# Altium project WaseyPad.PrjPcb
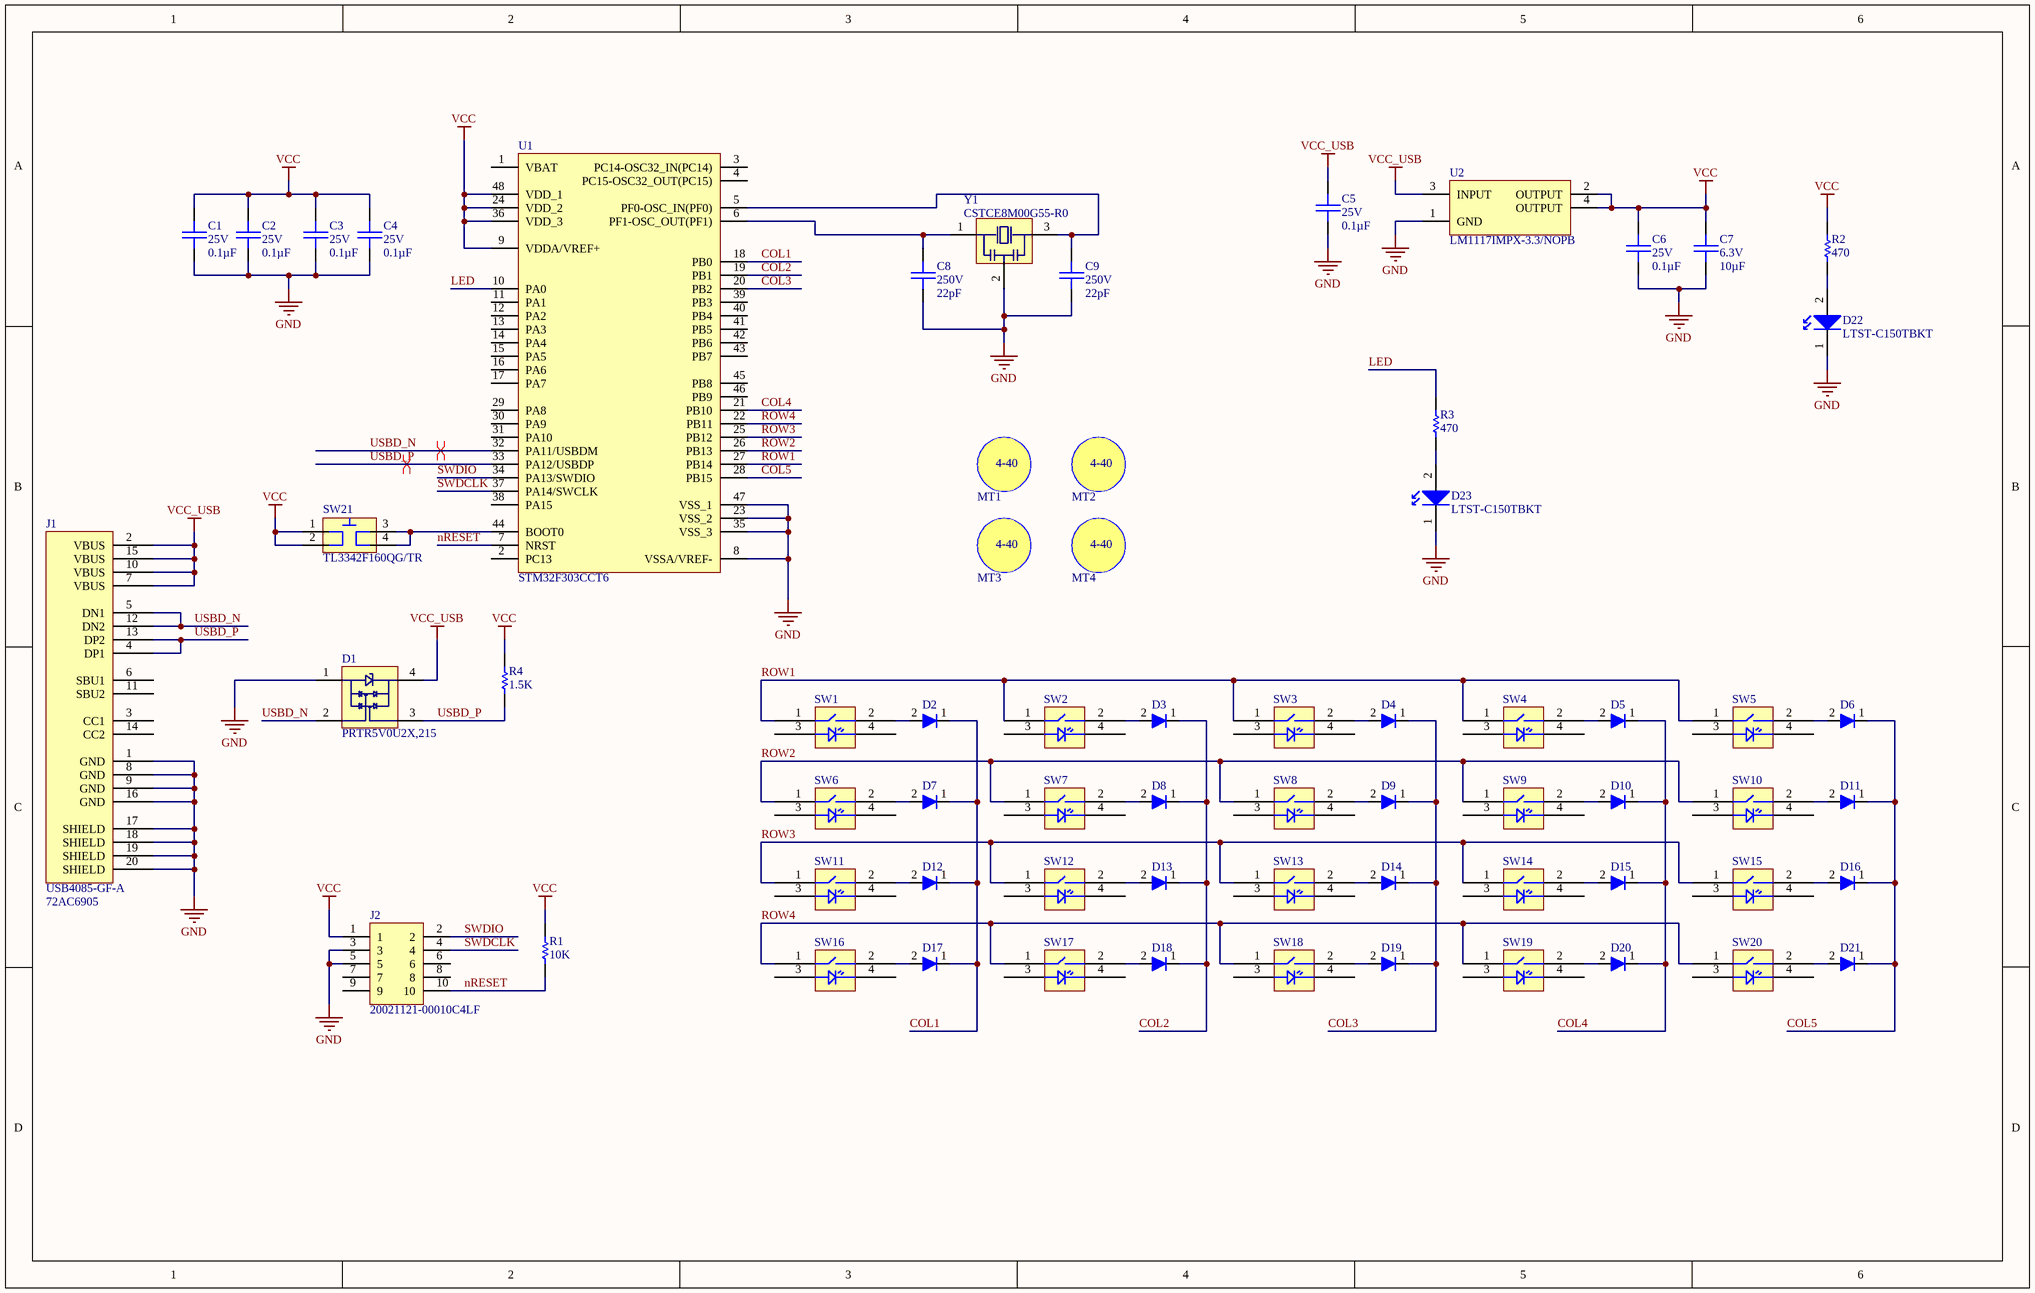
[diagram p0: Sheet1.SchDoc]
1 sheet, 66 parts. Net scope: global (net labels, ports and power ports of the same name join across sheets).
Board file: PCB1.PcbDoc

## Sheet Sheet1.SchDoc
size B

### Parts
C1  value 0.1µF  Voltage: 25V  [CAPC_0603(1.6X0.8)_N]  (hidden comment: Generic CAPC 0603 0.1µF 25V ±10% X7R)
C2  value 0.1µF  Voltage: 25V  [CAPC_0603(1.6X0.8)_N]  (hidden comment: Generic CAPC 0603 0.1µF 25V ±10% X7R)
C3  value 0.1µF  Voltage: 25V  [CAPC_0603(1.6X0.8)_N]  (hidden comment: Generic CAPC 0603 0.1µF 25V ±10% X7R)
C4  value 0.1µF  Voltage: 25V  [CAPC_0603(1.6X0.8)_N]  (hidden comment: Generic CAPC 0603 0.1µF 25V ±10% X7R)
C5  value 0.1µF  Voltage: 25V  [CAPC_0603(1.6X0.8)_N]  (hidden comment: Generic CAPC 0603 0.1µF 25V ±10% X7R)
C6  value 0.1µF  Voltage: 25V  [CAPC_0603(1.6X0.8)_N]  (hidden comment: Generic CAPC 0603 0.1µF 25V ±10% X7R)
C7  value 10µF  Voltage: 6.3V  [CAPC_0603(1.6X0.8)_N]  (hidden comment: Generic CAPC 0603 10µF 6.3V ±20% X5R)
C8  value 22pF  Voltage: 250V  [CAPC_0603(1.6X0.8)_N]  (hidden comment: Generic CAPC 0603 22pF 250V ±2% C0G/NP0)
C9  value 22pF  Voltage: 250V  [CAPC_0603(1.6X0.8)_N]  (hidden comment: Generic CAPC 0603 22pF 250V ±2% C0G/NP0)
D1  TVS DIODE 5.5VWM SOT143B  [NXP_SOT143B_N]  (value not drawn)
D2  DIODE GEN PURP 100V 300MA SOD123  [1N4148W-7-F_N]  (value not drawn)
D3  DIODE GEN PURP 100V 300MA SOD123  [1N4148W-7-F_N]  (value not drawn)
D4  DIODE GEN PURP 100V 300MA SOD123  [1N4148W-7-F_N]  (value not drawn)
D5  DIODE GEN PURP 100V 300MA SOD123  [1N4148W-7-F_N]  (value not drawn)
D6  DIODE GEN PURP 100V 300MA SOD123  [1N4148W-7-F_N]  (value not drawn)
D7  DIODE GEN PURP 100V 300MA SOD123  [1N4148W-7-F_N]  (value not drawn)
D8  DIODE GEN PURP 100V 300MA SOD123  [1N4148W-7-F_N]  (value not drawn)
D9  DIODE GEN PURP 100V 300MA SOD123  [1N4148W-7-F_N]  (value not drawn)
D10  DIODE GEN PURP 100V 300MA SOD123  [1N4148W-7-F_N]  (value not drawn)
D11  DIODE GEN PURP 100V 300MA SOD123  [1N4148W-7-F_N]  (value not drawn)
D12  DIODE GEN PURP 100V 300MA SOD123  [1N4148W-7-F_N]  (value not drawn)
D13  DIODE GEN PURP 100V 300MA SOD123  [1N4148W-7-F_N]  (value not drawn)
D14  DIODE GEN PURP 100V 300MA SOD123  [1N4148W-7-F_N]  (value not drawn)
D15  DIODE GEN PURP 100V 300MA SOD123  [1N4148W-7-F_N]  (value not drawn)
D16  DIODE GEN PURP 100V 300MA SOD123  [1N4148W-7-F_N]  (value not drawn)
D17  DIODE GEN PURP 100V 300MA SOD123  [1N4148W-7-F_N]  (value not drawn)
D18  DIODE GEN PURP 100V 300MA SOD123  [1N4148W-7-F_N]  (value not drawn)
D19  DIODE GEN PURP 100V 300MA SOD123  [1N4148W-7-F_N]  (value not drawn)
D20  DIODE GEN PURP 100V 300MA SOD123  [1N4148W-7-F_N]  (value not drawn)
D21  DIODE GEN PURP 100V 300MA SOD123  [1N4148W-7-F_N]  (value not drawn)
D22  LED 468NM BLUE CLEAR 1206 SMD  [LTST-C150TBKT_N]  (value not drawn)
D23  LED 468NM BLUE CLEAR 1206 SMD  [LTST-C150TBKT_N]  (value not drawn)
J1  USB4085-GF-A  Supplier Part Number 1: 72AC6905  [GCT_USB4085-GF-A_MN]
J2  CONN HEADER 10POS DL UNSHRD SMD  [20021121-00010C4LF]  (value not drawn)
MT1  4-40 Mounting hole NPTH  [440LNPTH]  (value not drawn)
MT2  4-40 Mounting hole NPTH  [440LNPTH]  (value not drawn)
MT3  4-40 Mounting hole NPTH  [440LNPTH]  (value not drawn)
MT4  4-40 Mounting hole NPTH  [440LNPTH]  (value not drawn)
R1  value 10K  [RESC_0603(1.6X0.8)_N]  (hidden comment: Generic RES 0603 10K 0.1W 5%)
R2  value 470  [RESC_0603(1.6X0.8)_N]  (hidden comment: Generic RES 0603 470 0.1W 5%)
R3  value 470  [RESC_0603(1.6X0.8)_N]  (hidden comment: Generic RES 0603 470 0.1W 5%)
R4  value 1.5K  [RESC_0603(1.6X0.8)_N]  (hidden comment: Generic RES 0603 1.5K 0.1W 5%)
SW1  MX1A-E1NW  [CHRY_MXXX-XXXW_MA]  (value not drawn)
SW2  MX1A-E1NW  [CHRY_MXXX-XXXW_MA]  (value not drawn)
SW3  MX1A-E1NW  [CHRY_MXXX-XXXW_MA]  (value not drawn)
SW4  MX1A-E1NW  [CHRY_MXXX-XXXW_MA]  (value not drawn)
SW5  MX1A-E1NW  [CHRY_MXXX-XXXW_MA]  (value not drawn)
SW6  MX1A-E1NW  [CHRY_MXXX-XXXW_MA]  (value not drawn)
SW7  MX1A-E1NW  [CHRY_MXXX-XXXW_MA]  (value not drawn)
SW8  MX1A-E1NW  [CHRY_MXXX-XXXW_MA]  (value not drawn)
SW9  MX1A-E1NW  [CHRY_MXXX-XXXW_MA]  (value not drawn)
SW10  MX1A-E1NW  [CHRY_MXXX-XXXW_MA]  (value not drawn)
SW11  MX1A-E1NW  [CHRY_MXXX-XXXW_MA]  (value not drawn)
SW12  MX1A-E1NW  [CHRY_MXXX-XXXW_MA]  (value not drawn)
SW13  MX1A-E1NW  [CHRY_MXXX-XXXW_MA]  (value not drawn)
SW14  MX1A-E1NW  [CHRY_MXXX-XXXW_MA]  (value not drawn)
SW15  MX1A-E1NW  [CHRY_MXXX-XXXW_MA]  (value not drawn)
SW16  MX1A-E1NW  [CHRY_MXXX-XXXW_MA]  (value not drawn)
SW17  MX1A-E1NW  [CHRY_MXXX-XXXW_MA]  (value not drawn)
SW18  MX1A-E1NW  [CHRY_MXXX-XXXW_MA]  (value not drawn)
SW19  MX1A-E1NW  [CHRY_MXXX-XXXW_MA]  (value not drawn)
SW20  MX1A-E1NW  [CHRY_MXXX-XXXW_MA]  (value not drawn)
SW21  Manufacturer Part Number: TL3342F160QG/TR  [TL3342F160QG-TR]  (hidden comment: SWITCH TACTILE SPST-NO 0.05A 12V)
U1  32BIT, CORTEX-M4, 72MHZ, LQFP-48  [ST_LQFP-48-7x7x1.4_MN]  (value not drawn)
U2  Manufacturer Part Number: LM1117IMPX-3.3/NOPB  [TI_DCY-R-PDSO-G4_N]  (hidden comment: IC REG LDO 3.3V 0.8A SOT223)
Y1  CER RESONATOR 8.00MHZ SMD  [CSTCE8M00G55-R0]  (value not drawn)

### Nets
GND: C1.2 C2.2 C3.2 C4.2 C5.2 C6.2 C7.2 C8.2 C9.2 D1.1(GND) D22.1(K) D23.1(K) J1.1(GND) J1.8(GND) J1.9(GND) J1.16(GND) J1.17(SHIELD) J1.18(SHIELD) J1.19(SHIELD) J1.20(SHIELD) J2.3 J2.5 U1.8(VSSA/VREF-) U1.23(VSS_2) U1.35(VSS_3) U1.47(VSS_1) U2.1(GND) Y1.2
VCC: C1.1 C2.1 C3.1 C4.1 C6.1 C7.1 J2.1 R1.2 R2.2 R4.2 SW21.1 SW21.2 U1.9(VDDA/VREF+) U1.24(VDD_2) U1.36(VDD_3) U1.48(VDD_1) U2.2(OUTPUT) U2.4(OUTPUT)
VCC_USB: C5.1 D1.4(VCC) J1.2(VBUS) J1.7(VBUS) J1.10(VBUS) J1.15(VBUS) U2.3(INPUT)
COL1: D2.1(K) D7.1(K) D12.1(K) D17.1(K) U1.18(PB0)
COL2: D3.1(K) D8.1(K) D13.1(K) D18.1(K) U1.19(PB1)
COL3: D4.1(K) D9.1(K) D14.1(K) D19.1(K) U1.20(PB2)
COL4: D5.1(K) D10.1(K) D15.1(K) D20.1(K) U1.21(PB10)
COL5: D6.1(K) D11.1(K) D16.1(K) D21.1(K) U1.28(PB15)
LED: R3.2 U1.10(PA0)
nRESET: J2.10 R1.1 U1.7(NRST)
ROW1: SW1.1 SW2.1 SW3.1 SW4.1 SW5.1 U1.27(PB14)
ROW2: SW6.1 SW7.1 SW8.1 SW9.1 SW10.1 U1.26(PB13)
ROW3: SW11.1 SW12.1 SW13.1 SW14.1 SW15.1 U1.25(PB12)
ROW4: SW16.1 SW17.1 SW18.1 SW19.1 SW20.1 U1.22(PB11)
SWDCLK: J2.4 U1.37(PA14/SWCLK)
SWDIO: J2.2 U1.34(PA13/SWDIO)
USBD_N: D1.2(IO1) J1.5(DN1) J1.12(DN2) U1.32(PA11/USBDM)
USBD_P: D1.3(IO2) J1.4(DP1) J1.13(DP2) R4.1 U1.33(PA12/USBDP)
NetC8_1: C8.1 U1.6(PF1-OSC_OUT(PF1)) Y1.1
NetC9_1: C9.1 U1.5(PF0-OSC_IN(PF0)) Y1.3
NetD2_2: D2.2(A) SW1.2
NetD3_2: D3.2(A) SW2.2
NetD4_2: D4.2(A) SW3.2
NetD5_2: D5.2(A) SW4.2
NetD6_2: D6.2(A) SW5.2
NetD7_2: D7.2(A) SW6.2
NetD8_2: D8.2(A) SW7.2
NetD9_2: D9.2(A) SW8.2
NetD10_2: D10.2(A) SW9.2
NetD11_2: D11.2(A) SW10.2
NetD12_2: D12.2(A) SW11.2
NetD13_2: D13.2(A) SW12.2
NetD14_2: D14.2(A) SW13.2
NetD15_2: D15.2(A) SW14.2
NetD16_2: D16.2(A) SW15.2
NetD17_2: D17.2(A) SW16.2
NetD18_2: D18.2(A) SW17.2
NetD19_2: D19.2(A) SW18.2
NetD20_2: D20.2(A) SW19.2
NetD21_2: D21.2(A) SW20.2
NetD22_2: D22.2(A) R2.1
NetD23_2: D23.2(A) R3.1
NetSW21_3: SW21.3 SW21.4 U1.44(BOOT0)

Not connected (* = marked no-connect by the designer): J1 3(CC1) 6(SBU1) 11(SBU2) 14(CC2); J2 6 7 8 9; SW1 3 4; SW2 3 4; SW3 3 4; SW4 3 4; SW5 3 4; SW6 3 4; SW7 3 4; SW8 3 4; SW9 3 4; SW10 3 4; SW11 3 4; SW12 3 4; SW13 3 4; SW14 3 4; SW15 3 4; SW16 3 4; SW17 3 4; SW18 3 4; SW19 3 4; SW20 3 4; U1 1(VBAT) 2(PC13) 3(PC14-OSC32_IN(PC14)) 4(PC15-OSC32_OUT(PC15)) 11(PA1) 12(PA2) 13(PA3) 14(PA4) 15(PA5) 16(PA6) 17(PA7) 29(PA8) 30(PA9) 31(PA10) 38(PA15) 39(PB3) 40(PB4) 41(PB5) 42(PB6) 43(PB7) 45(PB8) 46(PB9)

### Layout directives
differential pair: USBD_N, USBD_P

### Notes on the sheet
- (in symbol 4-40_NPTH) 4-40

### Library data of the parts
C1-C6 = SFE-CAPC-0603-0.1µF-25V-±10%-X7R: Generic Capacitor; Case-IEC: 0603; capacitance: 0.0000001; Case-Metric: *; Tolerance: ±10%; DesignID: SFE-CAPC-0603-0.1µF-25V-±10%-X7R; Manufacturer: Generic; Manufacturer Part Number: SFE-CAPC-0603-0.1µF-25V-±10%-X7R
C7 = SFE-CAPC-0603-10µF-6.3V-±20%-X5R: Generic Capacitor; Case-IEC: 0603; capacitance: 0.00001; Case-Metric: *; Tolerance: ±20%; DesignID: SFE-CAPC-0603-10µF-6.3V-±20%-X5R; Manufacturer: Generic; Manufacturer Part Number: SFE-CAPC-0603-10µF-6.3V-±20%-X5R
C8 C9 = SFE-CAPC-0603-22pF-250V-±2%-C0G/NP0: Generic Capacitor; Case-IEC: 0603; capacitance: 0.000000000022; Case-Metric: *; Tolerance: ±2%; DesignID: SFE-CAPC-0603-22pF-250V-±2%-C0G/NP0; Manufacturer: Generic; Manufacturer Part Number: SFE-CAPC-0603-22pF-250V-±2%-C0G/NP0
D1 = PRTR5V0U2X,215: Manufacturer: NXP Semiconductors; SafariPartNumber: 15 27314RC; Type: Steering (Rail to Rail); Bidirectional Channels: 2; Voltage - Reverse Standoff (Typ): 5.5V (Max); Voltage - Breakdown (Min): 6V; Power Line Protection: Yes; Capacitance @ Frequency: 1pF @ 1MHz; Supplier 1: Digi-Key; Supplier Part Number 1: 568-4140-1-ND; RoHS: RoHS Compliant; Category: Circuit Protection; Stock 1: 19762; Pricing 1: 1=0.57, 10=0.477, 25=0.418, 100=0.3578, 250=0.31036, 500=0.26286, 1000=0.20265 (USD); Packaging: Cut Tape (CT); Unidirectional Channels: -; Voltage - Clamping (Max) @ Ipp: -; Current - Peak Pulse (10/1000µs): -; Power - Peak Pulse: -; Applications: General Purpose; Operating Temperature: -40°C ~ 85°C (TA); Mounting Type: Surface Mount; Package / Case: TO-253-4, TO-253AA; Supplier Device Package: SOT-143B; ComponentLink1URL: https://assets.nexperia.com/documents/data-sheet/PRTR5V0U2X.pdf; ComponentLink1Description: Datasheet; Manufacturer Part Number: PRTR5V0U2X,215; DesignID: PRTR5V0U2X,215
D2-D21 = 1N4148W-7-F: Manufacturer: Diodes Incorporated; SafariPartNumber: 15 15821RC; Diode Type: Standard; Current - Average Rectified (Io): 300mA (DC); Voltage - Forward (Vf) (Max) @ If: 1.25V @ 150mA; Speed: Small Signal =< 200mA (Io), Any Speed; Reverse Recovery Time (trr): 4ns; Current - Reverse Leakage @ Vr: 1µA @ 75V; Capacitance @ Vr, F: 2pF @ 0V, 1MHz; Supplier 1: Digi-Key; Supplier Part Number 1: 1N4148W-FDICT-ND; RoHS: RoHS Compliant; Category: Discrete Semiconductor Products; Stock 1: 649808; Pricing 1: 1=0.16, 10=0.149, 100=0.081, 500=0.04986, 1000=0.03399 (USD); Packaging: Cut Tape (CT); Part Status: Active; Voltage - DC Reverse (Vr) (Max): 100V; Mounting Type: Surface Mount; Package / Case: SOD-123; Supplier Device Package: SOD-123; Operating Temperature - Junction: -65°C ~ 150°C; ComponentLink1URL: http://www.diodes.com/_files/datasheets/ds30086.pdf; ComponentLink1Description: http://www.diodes.com/_files/datasheets/ds30086.pdf; Manufacturer Part Number: 1N4148W-7-F; DesignID: 1N4148W-7-F
D22 D23 = LTST-C150TBKT: Manufacturer: Lite-On Inc; SafariPartNumber: 15 25012RC; Wavelength - Dominant: 470nm; Millicandela Rating: 104mcd; Voltage - Forward (Vf) (Typ): 3.3V; Current - Test: 20mA; Viewing Angle: 130°; Lens Style/Size: Rectangle with Flat Top, 2.06mm x 1.6mm; Supplier 1: Digi-Key; Supplier Part Number 1: 160-1643-1-ND; RoHS: RoHS Compliant; Category: Optoelectronics; Stock 1: 267579; Pricing 1: 1=0.5, 10=0.369, 100=0.1956, 250=0.13836, 500=0.11808, 1000=0.09225 (USD); Packaging: Cut Tape (CT); Color: Blue; Wavelength - Peak: 468nm; Lens Type: Clear; Package / Case: 1206 (3216 Metric); Size / Dimension: 3.20mm L x 1.60mm W; Height: 1.10mm; Mounting Type: Surface Mount; Luminous Flux @ Current - Test: -; ComponentLink1URL: http://optoelectronics.liteon.com/upload/download/DS22-2000-026/S_110_LTST-C150TBKT(0630).pdf; ComponentLink1Description: http://optoelectronics.liteon.com/upload/download/DS22-2000-026/S_110_LTST-C150TBKT(0630).pdf; Manufacturer Part Number: LTST-C150TBKT; DesignID: LTST-C150TBKT
J1 = USB4085-GF-A: USB4085 Series 20 V PCB Top Mount USB 2.0 Type C Receptacle; Manufacturer 1: Global Connector Technology; USB Standard: USB 2.0; Number of Positions: 16; Supplier 1: Newark; Manufacturer Part Number 1: USB4085-GF-A; RoHS: No; Pricing 1: 1=1.38000, 10=1.23000, 25=1.15000, 50=1.06000, 100=0.91100, 250=0.83700, 700=0.77300, 1400=0.72600 (USD); Contact Material: Copper Alloy; Contact Plating: Gold; Gender: Receptacle; Orientation: Right Angle; ComponentLink1URL: https://datasheet.ciiva.com/71788/2674755-71788146.pdf?src-supplier=Element14; ComponentLink1Description: https://datasheet.ciiva.com/71788/2674755-71788146.pdf?src-supplier=Element14; ComponentLink2URL: https://datasheet.ciiva.com/71788/usb4085-71788147.pdf?src-supplier=Digi-Key; ComponentLink2Description: https://datasheet.ciiva.com/71788/usb4085-71788147.pdf?src-supplier=Digi-Key
J2 = 20021121-00010C4LF: Manufacturer: FCI; Connector Type: Header, Unshrouded; Number of Positions: 10; Number of Positions Loaded: All; Pitch: 0.050" (1.27mm); Supplier 1: Digi-Key; Supplier Part Number 1: 609-3695-1-ND; RoHS: RoHS Compliant; Category: Connectors, Interconnects; Stock 1: 32337; Pricing 1: 1=0.8, 10=0.701, 25=0.66, 50=0.6326, 100=0.605, 250=0.55 (USD); Packaging: Cut Tape (CT); Contact Type: Male Pin; Number of Rows: 2; Row Spacing: 0.050" (1.27mm); Contact Mating Length: 0.120" (3.05mm); Mounting Type: Surface Mount; Termination: Solder; Fastening Type: -; Features: -; Contact Finish: Gold; Contact Finish Thickness: 10µin (0.25µm); Color: Black; ComponentLink1URL: http://portal.fciconnect.com/Comergent//fci/drawing/20021121.pdf; ComponentLink1Description: http://portal.fciconnect.com/Comergent//fci/drawing/20021121.pdf; Manufacturer Part Number: 20021121-00010C4LF; DesignID: 20021121-00010C4LF
MT1-MT4 = 4-40_NPTH: DesignID: 4-40_NPTH; Manufacturer Part Number: 4-40_NPTH
R1 = SFE-RES-0603-10K-0.1W-5%: Generic Resistor; Temperature Coefficient: PPM; Case-IEC: 0603; ValueString: 10K5%; Resistance: 10000; Tolerance: 5%; Power: 0.1W; DesignID: SFE-RES-0603-10K-0.1W-5%; Manufacturer: Generic; Manufacturer Part Number: SFE-RES-0603-10K-0.1W-5%
R2 R3 = SFE-RES-0603-470-0.1W-5%: Generic Resistor; Temperature Coefficient: PPM; Case-IEC: 0603; ValueString: 4705%; Tolerance: 5%; Power: 0.1W; DesignID: SFE-RES-0603-470-0.1W-5%; Manufacturer: Generic; Manufacturer Part Number: SFE-RES-0603-470-0.1W-5%; Resistance: 470
R4 = SFE-RES-0603-1.5K-0.1W-5%: Generic Resistor; Temperature Coefficient: PPM; Case-IEC: 0603; ValueString: 1.5K5%; Resistance: 1500; Tolerance: 5%; Power: 0.1W; DesignID: SFE-RES-0603-1.5K-0.1W-5%; Manufacturer: Generic; Manufacturer Part Number: SFE-RES-0603-1.5K-0.1W-5%
SW1-SW20 = MX1A-E1NW: SWITCH PUSH SPST-NO 0.01A 12V; Manufacturer 1: Cherry; Mechanical Life: 20000000Cycles; Throw Configuration: SPST; Current Rating: 10mA; Contact Resistance: 200mR; Operating Force: 0.5N; Switch Function: Off-Mom; Row Spacing: 2.54mm; Actuator Length: 3.6mm; Supplier 1: Digi-Key; Stock 1: 7477; Pricing 1: 1=0.90000, 10=0.84000, 25=0.80000, 50=0.76000, 100=0.74000, 250=0.72000, 500=0.68000, 1000=0.64000, 5000=0.54000 (USD); RoHS: Yes; Mount: Through Hole; Contact Plating: Gold; Contact Material: Gold,Silver; Number of Terminals: 2; Housing Material: Thermoplastic; Min Operating Temperature: -10°C; Max Operating Temperature: 70°C; Voltage Rating (AC): 12V; Voltage Rating (DC): 12V; Packaging: Bulk; Max Voltage Rating (AC): 12V; Max Voltage Rating (DC): 12V; Max Current Rating: 10mA; Package Quantity: 1000; Termination: PC Pin; Electrical Life: 20000000Cycles; Orientation: Straight; Contact Current Rating: 10mA; Length: 15.6mm; Terminal Pitch: 6.35mm; Width: 15.6mm; Lead Free: Lead Free; Flammability Rating: UL94 HB; ComponentLink1URL: https://datasheet.ciiva.com/2869/mx20series-2869568.pdf?src-supplier=Digi-Key; ComponentLink1Description: https://datasheet.ciiva.com/2869/mx20series-2869568.pdf?src-supplier=Digi-Key; ComponentLink2URL: https://datasheet.ciiva.com/5259/mx-cat-216303-5259204.pdf?src-supplier=Mouser; ComponentLink2Description: https://datasheet.ciiva.com/5259/mx-cat-216303-5259204.pdf?src-supplier=Mouser; Supplier Part Number 1: CH197-ND; Manufacturer Part Number 1: MX1A-E1NW
SW21 = TL3342F160QG/TR: Manufacturer: E-Switch; Switch Function: Off-Mom; Contact Rating @ Voltage: 0.05A @ 12VDC; Actuator Type: Standard; Actuator Height off PCB, from Pins: 1.54mm; Actuator Orientation: Top Actuated; Outline: 4.90mm x 4.90mm; Illumination: Non-Illuminated; Operating Force: 160gf; Actuator Material: Polyphenylene Sulfide (PPS); Mechanical Life: 100,000 Cycles; Supplier 1: Digi-Key; Supplier Part Number 1: EG2531CT-ND; RoHS: RoHS Compliant; Category: Switches; Stock 1: 54320; Pricing 1: 1=0.63, 10=0.603, 25=0.5916, 50=0.5694, 100=0.4913, 250=0.4466, 500=0.42428, 1000=0.33495 (USD); Packaging: Cut Tape (CT); Circuit: SPST-NO; Mounting Type: Surface Mount; Termination Style: Gull Wing; Illumination Voltage (Nominal): -; Illumination Type, Color: -; Ingress Protection: -; Features: -; Switch Travel: -; Operating Temperature: -; ComponentLink1URL: https://www.e-switch.com/system/asset/product_line/data_sheet/165/TL3342.pdf; ComponentLink1Description: https://www.e-switch.com/system/asset/product_line/data_sheet/165/TL3342.pdf; DesignID: TL3342F160QG/TR
U1 = STM32F303CCT6: Manufacturer 1: STMicroelectronics; Manufacturer: ST Micro; Number of I/Os: 37; Interface: I2C,SPI,USB,CAN,IrDA,UART,USART,LIN,I2S; RAM Size: 40KB; Number of Timers/Counters: 10; Oscillator Type: Internal; Number of Programmable I/O: 27; Data Bus Width: 32b; Watchdog Timer: Yes; Memory Type: FLASH; Memory Size: 256KB; Peripherals: POR,PWM,WDT,DMA; Core Architecture: ARM; Max Supply Voltage: 3.6V; Min Supply Voltage: 2V; Number of ADC Channels: 39; Number of SPI Channels: 3; Number of I2C Channels: 2; Number of USB Channels: 1; Supplier 1: Digi-Key; Stock 1: 5656; Pricing 1: 1=5.94000, 10=5.33600, 100=4.37190, 500=3.72172, 1000=3.13880 (USD); RoHS: Yes; Case/Package: LQFP; Number of Pins: 48; Contact Plating: Gold; Min Operating Temperature: -40°C; Max Operating Temperature: 85°C; Frequency: 72MHz; Packaging: Tray; Max Frequency: 72MHz; Package Quantity: 250; Length: 10mm; Height: 1.45mm; Width: 7.2mm; Radiation Hardening: No; Lead Free: Lead Free; REACH SVHC: No SVHC; ComponentLink1URL: https://datasheet.ciiva.com/14666/0900766b81171360-14666656.pdf?src-supplier=RSComponents; ComponentLink1Description: https://datasheet.ciiva.com/14666/0900766b81171360-14666656.pdf?src-supplier=RSComponents; ComponentLink2URL: https://datasheet.ciiva.com/8055/1831499-8055015.pdf?src-supplier=Element14; ComponentLink2Description: https://datasheet.ciiva.com/8055/1831499-8055015.pdf?src-supplier=Element14; Supplier Part Number 1: 497-13318-ND; Manufacturer Part Number 1: STM32F303CCT6; DesignID: STM32F303CCT6; Manufacturer Part Number: STM32F303CCT6
U2 = LM1117IMPX-3.3/NOPB: Manufacturer: Texas Instruments; SafariPartNumber: 15 24656RC; Regulator Topology: Positive Fixed; Current - Output: 800mA; Voltage - Dropout (Typical): 1.2V @ 800mA; Number of Regulators: 1; Voltage - Input: Up to 15V; Supplier 1: Digi-Key; Supplier Part Number 1: LM1117IMPX-3.3/NOPBCT-ND; RoHS: RoHS Compliant; Category: Integrated Circuits (ICs); Stock 1: 19906; Pricing 1: 1=1.04, 10=0.927, 100=0.7229, 500=0.5978, 1000=0.47275 (USD); Packaging: Cut Tape (CT); Voltage - Output: 3.3V; Current - Limit (Min): 800mA; Operating Temperature: -40°C ~ 125°C; Mounting Type: Surface Mount; Package / Case: TO-261-4, TO-261AA; Supplier Device Package: SOT-223-4; ComponentLink1URL: http://www.ti.com/lit/ds/symlink/lm1117.pdf; ComponentLink1Description: http://www.ti.com/lit/ds/symlink/lm1117.pdf; Supplier 2: Mouser; Supplier Part Number 2: 926-LM1117IMPX33NOPB; Supplier 3: Newark; Supplier Part Number 3: 28X3413; DesignID: LM1117IMPX-3.3/NOPB
Y1 = CSTCE8M00G55-R0: Manufacturer: Murata Electronics North America; Frequency: 8MHz; Frequency Stability: ±0.2%; Frequency Tolerance: ±0.5%; Capacitance: 33pF; Supplier 1: Digi-Key; Supplier Part Number 1: 490-1195-1-ND; RoHS: RoHS Compliant; Category: Crystals and Oscillators; Stock 1: 11412; Pricing 1: 1=0.46, 10=0.384, 50=0.3456, 100=0.3074, 500=0.29134, 1000=0.24595 (USD); Packaging: Cut Tape (CT); Type: Ceramic; Features: Built in Capacitor; Impedance: -; Operating Temperature: -20°C ~ 80°C; Mounting Type: Surface Mount; Package / Case: 3-SMD, Non-Standard; Size / Dimension: 0.126" L x 0.051" W (3.20mm x 1.30mm); Height: 0.031" (0.80mm); ComponentLink1URL: http://www.murata.com/~/media/webrenewal/support/library/catalog/products/timingdevice/ceralock/p16e.ashx; ComponentLink1Description: http://www.murata.com/~/media/webrenewal/support/library/catalog/products/timingdevice/ceralock/p16e.ashx; Manufacturer Part Number: CSTCE8M00G55-R0; DesignID: CSTCE8M00G55-R0